# EAGLE design MXR2_v1 (EAGLE 7.1.0)
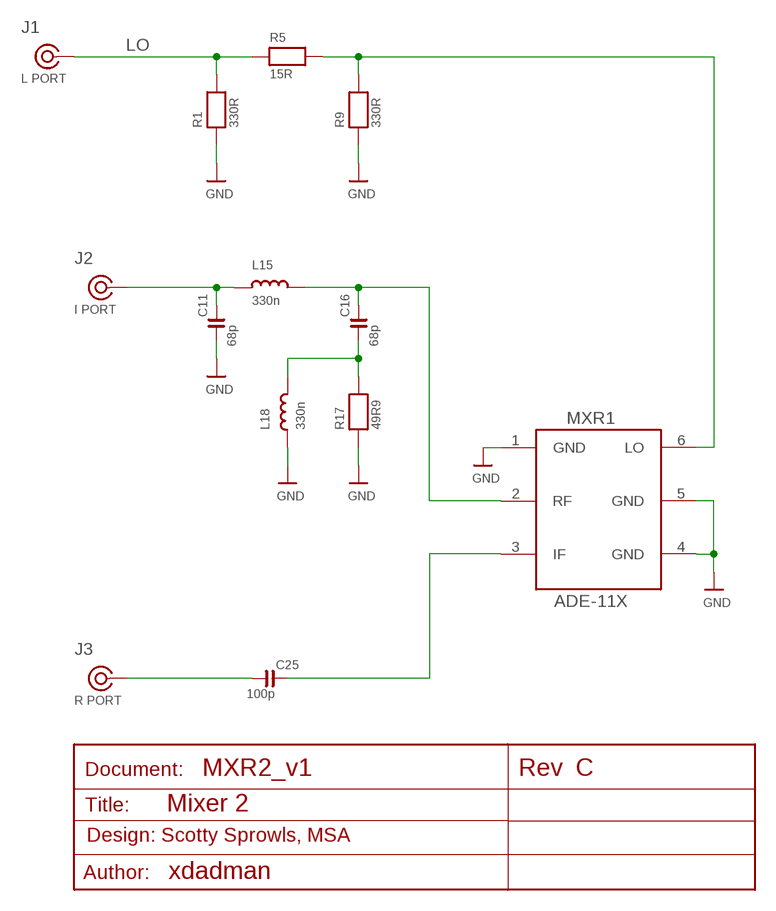
[diagram p0: schematic, sheet 1]

## Parts
C11  68p  C080568P  [C0805]
C16  68p  C080568P  [C0805]
C25  100p  C0805100P  [C0805]
J1  L PORT  COAX  [SLIM_COAX_PAD]
J2  I PORT  COAX  [SLIM_COAX_PAD]
J3  R PORT  COAX  [SLIM_COAX_PAD]
L15  330n  L0805330N  [L805]
L18  330n  L0805330N  [L805]
MXR1  ADE-11X  [ADE-11X]
R1  330R  R0805330R  [R0805]
R5  15R  R080515R  [0805]
R9  330R  R0805330R  [R0805]
R17  49R9  R080549R9  [R0805]

## Nets
GND: C11.1 L18.1 MXR1.1(GND) MXR1.4(GND) MXR1.5(GND) R1.1 R9.1 R17.1
IF: C25.1 J3.SIG
IF2: C25.2 MXR1.3(IF)
LO: J1.SIG R1.2 R5.1
LO3: MXR1.6(LO) R5.2 R9.2
N$7: C16.1 L18.2 R17.2
RF: C11.2 J2.SIG L15.1
RF2: C16.2 L15.2 MXR1.2(RF)

## Notes on the sheet
- C
- Mixer 2
- Design: Scotty Sprowls, MSA
- xdadman

## Power pins joined to a net without a drawn wire
GND: J1.GND J2.GND J3.GND

## Library data of the parts
C11 C16 = MSA_lib:C0805: Ceramic capacitor; OC_FARNELL: 1327692
C25 = MSA_lib:C0805: Ceramic capacitor; OC_FARNELL: 1414656
J1-J3 = MSA_lib:COAX
L15 L18 = MSA_lib:L0805: 0805 Inductor; OC_FARNELL: 9527923
MXR1 = MSA_lib:ADE-11X: RF Mixer; VENDOR: minicirquits
R1 R9 = MSA_lib:R0805: Resistors; OC_FARNELL: 2078951
R5 = MSA_lib:R0805: Resistors; OC_FARNELL: 2332045
R17 = MSA_lib:R0805: Resistors; OC_FARNELL: 2312274

## Board

Size 32 x 32 mm. Coordinates in mm from the lower left corner, seen from the top.
Outline: 0,0 32,0 32,32 0,32
Outline: 0,0 0,32
Copper layers (1*16): Top 0.035mm / dielectric 1.5mm / Bottom 0.035mm
Design rules "kuba_no_CLR": minimum track width 8mil, minimum drill 15mil, track to track 8mil, track to pad 8mil, pad to pad 8mil, via to via 8mil, smd to smd 8mil, copper to edge 0mil, drill to drill 8mil, minimum pad ring 12mil, minimum via ring 10mil, stop-mask expansion 4mil, vias tented up to drill 0mil, thermal gap 10mil

### Footprints (pad centres in the part's own frame; a part is rotated, then mirrored left to right if it is on the bottom)
C0805 = smd 1.2 x 1.5: 1 -0.953,0; 2 0.953,0
SLIM_COAX_PAD = smd 1.27 x 0.635 bottom: GND 0,-2.667 | drill 1.1: SIG 0,0
L805 = smd 1.3 x 1.5: 1 -0.95,0; 2 0.95,0
ADE-11X = smd 1.65 x 2.54: 1 -2.54,-2.54; 2 0,-2.54; 3 2.54,-2.54; 4 2.54,2.54; 5 0,2.54; 6 -2.54,2.54
R0805 = smd 1.3 x 1.5: 1 -0.95,0; 2 0.95,0
0805 = smd 1.3 x 1.5: 1 -0.95,0; 2 0.95,0

### Placement (x,y rotation side)
C11  8.77,5.21 90 top
C16  7.12,16.51 0 top
C25  20.07,12.7 180 top
J1  10.29,24.26 270 top
J2  8.72,7.19 0 top
J3  25.91,12.7 90 top
L15  8.64,12.7 90 top
L18  5.21,18.16 0 top
MXR1  18.17,18.16 270 top
R1  8.26,24.26 0 top
R5  16.26,24.26 0 top
R9  22.36,24.26 180 top
R17  5.08,14.86 0 top

### Tracks (layer width: path | path; a pad name or v marks a point on that pad's centre or on a via)
GND  (via drill 0.5)
  Top 0.406: MXR1.1 15.62,20.32 | 20.2,18.67 MXR1.5 MXR1.4
  Top 0.61: C11.1 8.77,3.56
  other vias: 1.78,1.65 6.48,1.65 10.93,1.65 14.99,1.65 19.31,1.65 23.88,1.65 27.94,1.65 29.98,1.91 29.72,5.21 29.72,20.95 29.72,25.78 29.72,30.1 26.67,30.1 20.58,30.1 14.48,30.1 7.88,30.1 1.78,29.84 1.78,27.3 1.78,23.5 1.78,19.43 1.78,15.11 1.78,11.05 1.78,6.73 11.94,15.37 11.94,12.83 11.94,9.53 11.94,6.22 10.42,4.19 5.08,4.19 13.97,8 18.04,8 21.85,8 29.21,9.53 29.21,12.32 28.96,15.11 26.17,15.62 18.04,15.11 18.04,16.64 18.04,18.16 18.04,19.68 18.04,20.83 16.51,21.08 14.74,21.08 11.94,21.08 9.66,21.08 7.37,22.61 7.37,25.91 6.35,24.13 7.37,27.69 20.32,15.62 20.32,18.16 22.86,18.16 23.12,15.62 28.2,8.08 24.39,24.26 25.15,8.08 8.77,3.68
  pour Top (no thermals): 10.8,0.1 10.8,16.18 13.39,16.18 13.39,0.1
  pour Top (no thermals): 0.87,19.91 16.79,19.91 16.79,22.25 0.87,22.25
  pour Top (no thermals): 27.94,14.73 17.81,14.73 17.81,19.94 16.77,19.94 16.77,22.23 18.29,22.23 18.29,18.92 22.99,18.92 22.99,28.07 0,28.07 0,32 32,32 32,0 27.94,0
  pour Top (no thermals): 0,32 0,0 32,0 32,9.02 13.47,9.02 13.47,4.95 4.83,4.95 4.83,21.97 8,21.97 8,28.32 4.45,28.32 4.45,32
  pour Bottom: 0,0 0,32 32,32 32,0
IF
  Top 0.203: 22.74,12.7 C25.1
  Top 2.21: J3.SIG 22.74,12.7
  pour Top (no thermals): 20.45,11.71 20.45,13.72 22.99,13.72 22.99,11.71
IF2
  Top 0.203: C25.2 15.75,12.7 15.62,12.7 14.99,12.7 14.99,15.49 14.48,15.49 14.48,15.62 MXR1.3
  pour Top (no thermals): 14.43,12.19 14.43,16 16.84,16.03 16.84,12.22
  pour Top (no thermals): 14.43,11.76 14.43,13.72 19.69,13.72 19.69,11.76
LO
  Top 0.203: 13.59,24.26 R5.1 | R1.2 10.8,24.26
  Top 2.21: 10.8,24.26 13.59,24.26
  Top 2.54: J1.SIG 10.8,24.26
  pour Top (no thermals): 13.44,23.27 15.78,23.27 15.78,25.27 13.44,25.27
LO3
  Top 0.203: R9.2 21.34,24.26
  Top 0.406: R5.2 21.34,24.26 | 21.34,24.26 21.34,20.7 MXR1.6 | 21.34,24.77 21.34,24.26
  pour Top (no thermals): 19.38,20.45 19.38,24.26 21.9,24.26 21.9,20.45
  pour Top (no thermals): 16.62,23.27 21.87,23.27 21.87,25.27 16.62,25.27
N$1
  pour Top (no thermals): 14.58,10.01 14.58,10.82 19.21,10.82 19.21,10.01
N$2
  pour Top (no thermals): 21.19,10.01 21.19,10.82 25.81,10.82 25.81,10.01
N$3
  pour Top (no thermals): 10.77,26.26 10.77,27.08 15.4,27.08 15.4,26.26
N$4
  pour Top (no thermals): 16.87,26.26 16.87,27.08 21.49,27.08 21.49,26.26
N$5
  pour Top (no thermals): 6.63,7.59 5.82,7.59 5.82,12.22 6.63,12.22
N$7
  Top 1.016: R17.2 6.03,16.38 C16.1 L18.2
  pour Top (no thermals): 6.63,14.2 5.82,14.2 5.82,18.82 6.63,18.82
RF
  Top 0.203: 8.69,10.36 8.62,10.36
  Top 1.016: J2.SIG 8.72,6.21 C11.2
  Top 2.21: 8.69,7.19 8.69,10.36
  Top 2.54: J2.SIG 8.69,7.19
  pour Top (no thermals): 7.67,9.83 9.71,9.83 9.71,12.24 7.67,12.24
RF2
  Top 0.203: MXR1.2 8.62,18.16
  pour Top (no thermals): 7.67,13.06 9.68,13.06 9.68,18.9 7.67,18.9
  pour Top (no thermals): 8.61,18.9 14.46,18.9 14.46,17.2 8.61,17.2

### Text on the board
tPlace: J1-LO | R5 | R9 | R1 | L18 | MXR1 | C16 | J3-R | R17 | L15 | C25 | Mixer 2 | C11 | J2-I | C:/temp/eemg_logo.bmp